# Altium schematic sheet MCU_144_IOs.SchDoc: MCU 144 I/Os
size A4; Date: Not used; ApprovedBy: Not used; CheckedBy: Not used; Author: Not used; CompanyName: STMicroelectronics; DrawnBy: Not used; Engineer: Not used; Organization: Not used; Address1: Not used; Address2: Not used; Address3: Not used; Address4: Not used; DocumentNumber: 3; Revision: Not used; SheetNumber: 3; SheetTotal: 9; CurrentTime: Not used; CurrentDate: Not used; Time: Not used; DocumentFullPathAndName: Not used; DocumentName: Not used; ModifiedDate: Not used; ImagePath: Not used; ProjectName: Not used; Application_BuildNumber: Not used
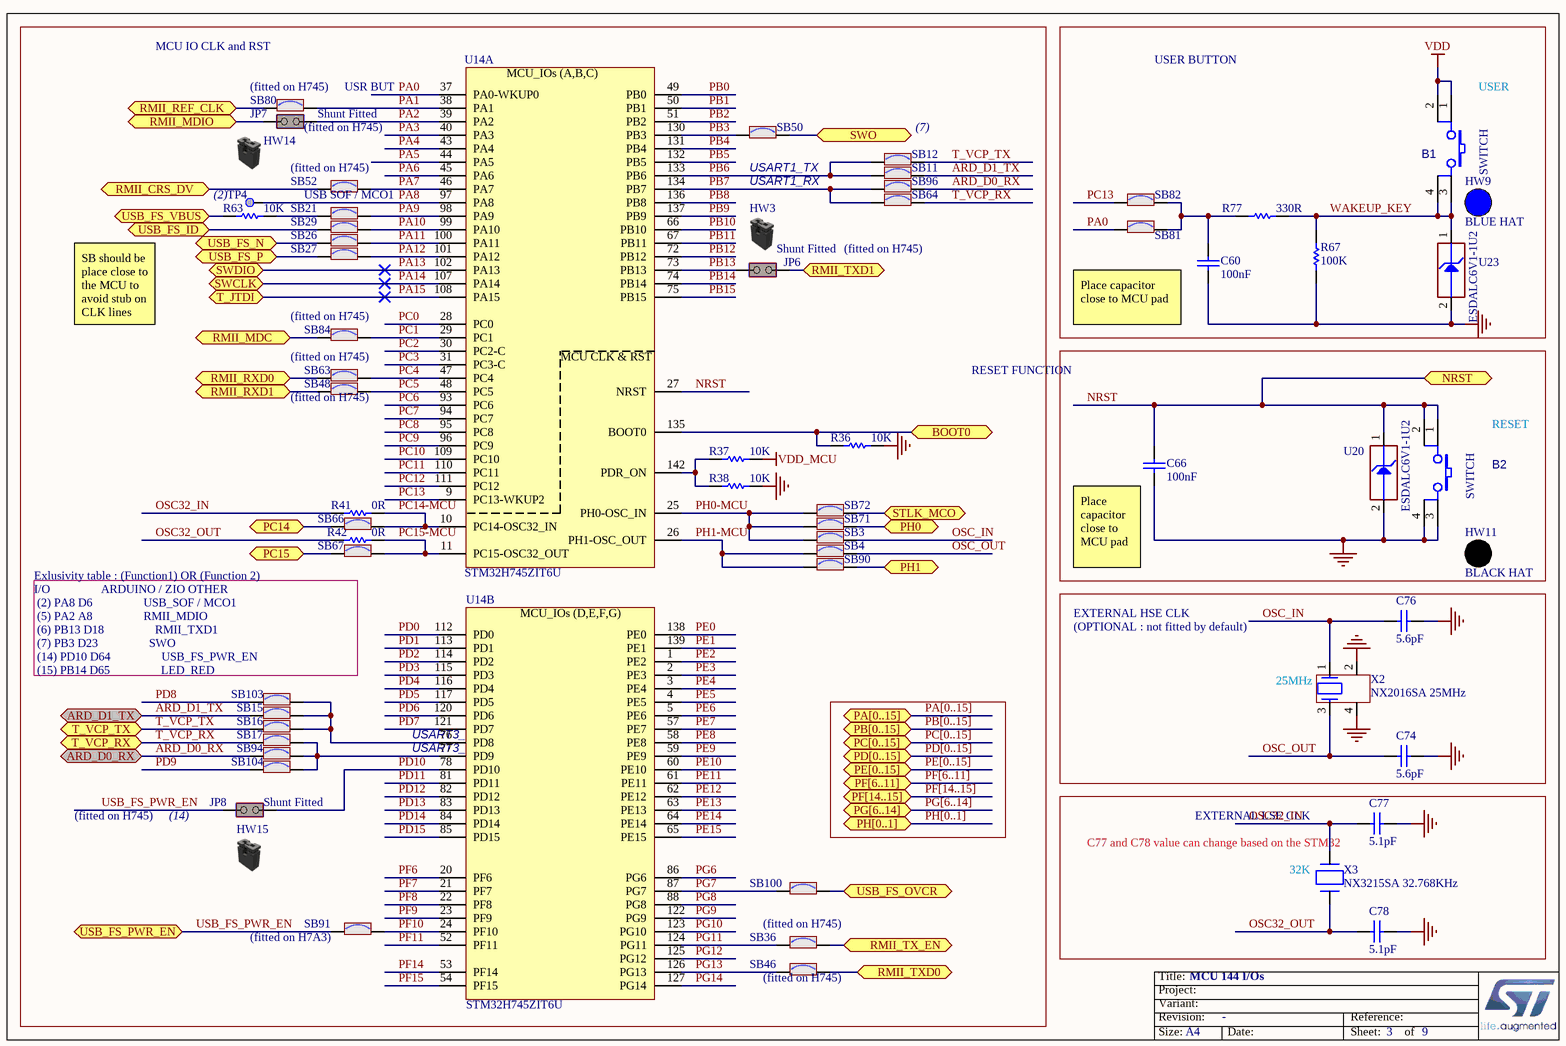
[diagram p0: MCU_144_IOs.SchDoc]

## Parts
B1  value SWITCH  [SWI_WEALTHMETAL_TD-0341_4P_BLUE]  (hidden comment: SW-PUSH-CMS)
B2  value SWITCH  [SWI_WEALTHMETAL_TD-0341_4P_BLACK]  (hidden comment: SW-PUSH-CMS)
C60  value 100nF  [C0603]  (hidden comment: Capacitor)
C66  value 100nF  [C0603]  (hidden comment: Capacitor)
C74  value 5.6pF  [C0402]  (hidden comment: Capacitor)
C76  value 5.6pF  [C0402]  (hidden comment: Capacitor)
C77  value 5.1pF  [C0603]  (hidden comment: Capacitor)
C78  value 5.1pF  [C0603]  (hidden comment: Capacitor)
HW3  Shunt Black 2.54mm  (value not drawn)  (mechanical)
HW9  value BLUE HAT  (hidden comment: BUTTON_HAT_BLUE)  (mechanical)
HW11  value BLACK HAT  (hidden comment: BUTTON_HAT_BLACK)  (mechanical)
HW14  Shunt Black 2.54mm  (value not drawn)  (mechanical)
HW15  Shunt Black 2.54mm  (value not drawn)  (mechanical)
JP6  value Shunt Fitted  [CON_SAMTEC_TSW-102-07-G-S]  (hidden comment: Jumper_Header 2x1 Fitted)
JP7  value Shunt Fitted  [CON_SAMTEC_TSW-102-07-G-S]  (hidden comment: Jumper_Header 2x1 Fitted)
JP8  value Shunt Fitted  [CON_SAMTEC_TSW-102-07-G-S]  (hidden comment: Jumper_Header 2x1 Fitted)
R36  value 10K  [R0603]  (hidden comment: Resistor)
R37  value 10K  [R0603]  (hidden comment: Resistor)
R38  value 10K  [R0603]  (hidden comment: Resistor)
R41  value 0R  [R0603]  (hidden comment: Resistor)
R42  value 0R  [R0603]  (hidden comment: Resistor)
R63  value 10K  [R0402]  (hidden comment: Resistor)
R67  value 100K  [R0603]  (hidden comment: Resistor)
R77  value 330R  [R0603]  (hidden comment: Resistor)
SB3  SB_ON  [SOLDER-BRIDGE_R0603-0R]  (value not drawn)
SB4  SB_ON  [SOLDER-BRIDGE_R0603-0R]  (value not drawn)
SB11  SB_ON  [SOLDER-BRIDGE_R0603-0R]  (value not drawn)
SB12  SB_ON  [SOLDER-BRIDGE_R0603-0R]  (value not drawn)
SB15  SB_ON  [SOLDER-BRIDGE_R0603-0R]  (value not drawn)
SB16  SB_ON  [SOLDER-BRIDGE_R0603-0R]  (value not drawn)
SB17  SB_ON  [SOLDER-BRIDGE_R0603-0R]  (value not drawn)
SB21  SB_ON  [SOLDER-BRIDGE_R0603-0R]  (value not drawn)
SB26  SB_ON  [SOLDER-BRIDGE_R0603-0R]  (value not drawn)
SB27  SB_ON  [SOLDER-BRIDGE_R0603-0R]  (value not drawn)
SB29  SB_ON  [SOLDER-BRIDGE_R0603-0R]  (value not drawn)
SB36  SB_ON  [SOLDER-BRIDGE_R0603-0R]  (value not drawn)
SB46  SB_ON  [SOLDER-BRIDGE_R0603-0R]  (value not drawn)
SB48  SB_ON  [SOLDER-BRIDGE_R0603-0R]  (value not drawn)
SB50  SB_ON  [SOLDER-BRIDGE_R0603-0R]  (value not drawn)
SB52  SB_ON  [SOLDER-BRIDGE_R0603-0R]  (value not drawn)
SB63  SB_ON  [SOLDER-BRIDGE_R0603-0R]  (value not drawn)
SB64  SB_ON  [SOLDER-BRIDGE_R0603-0R]  (value not drawn)
SB66  SB_ON  [SOLDER-BRIDGE_R0603-0R]  (value not drawn)
SB67  SB_ON  [SOLDER-BRIDGE_R0603-0R]  (value not drawn)
SB71  SB_ON  [SOLDER-BRIDGE_R0603-0R]  (value not drawn)
SB72  SB_ON  [SOLDER-BRIDGE_R0603-0R]  (value not drawn)
SB80  SB_ON  [SOLDER-BRIDGE_R0603-0R]  (value not drawn)
SB81  SB_ON  [SOLDER-BRIDGE_R0603-0R]  (value not drawn)
SB82  SB_ON  [SOLDER-BRIDGE_R0603-0R]  (value not drawn)
SB84  SB_ON  [SOLDER-BRIDGE_R0603-0R]  (value not drawn)
SB90  SB_ON  [SOLDER-BRIDGE_R0603-0R]  (value not drawn)
SB91  SB_ON  [SOLDER-BRIDGE_R0603-0R]  (value not drawn)
SB94  SB_ON  [SOLDER-BRIDGE_R0603-0R]  (value not drawn)
SB96  SB_ON  [SOLDER-BRIDGE_R0603-0R]  (value not drawn)
SB100  SB_ON  [SOLDER-BRIDGE_R0603-0R]  (value not drawn)
SB103  SB_ON  [SOLDER-BRIDGE_R0603-0R]  (value not drawn)
SB104  SB_ON  [SOLDER-BRIDGE_R0603-0R]  (value not drawn)
TP4  Test Point  [TP_SMD_1MM]  (value not drawn)  (no BOM)
U14  value STM32H745ZIT6U  [ICC_LQFP144_20X20_P050_SOCKET_YAMAICHI_IC149-144-145-B5_NM]  (hidden comment: STM32H7_LQFP144_SMPS)  (parts A,B of 3)
U20  value ESDALC6V1-1U2  [ESD_ST0201]  (hidden comment: ESD-TRANSIL)
U23  value ESDALC6V1-1U2  [ESD_ST0201]  (hidden comment: ESD-TRANSIL)
X2  value NX2016SA 25MHz  [CRY_NX2016SA_4P]  (hidden comment: XTAL_4_PINS)
X3  value NX3215SA 32.768KHz  [CRY_NX3215SA_2P]  (hidden comment: XTAL_2_PINS)

## Ports
ARD_D0_RX (bidir), ARD_D1_TX (bidir), BOOT0 (bidir), NRST (bidir), PA[0..15] (bidir), PB[0..15] (bidir), PC14 (bidir), PC15 (bidir), PC[0..15] (bidir), PD[0..15] (bidir), PE[0..15] (bidir), PF[6..11] (bidir), PF[14..15] (bidir), PG[6..14] (bidir), PH0 (bidir), PH1 (bidir), PH[0..1] (bidir), RMII_CRS_DV (bidir), RMII_MDC (bidir), RMII_MDIO (bidir), RMII_REF_CLK (bidir), RMII_RXD0 (bidir), RMII_RXD1 (bidir), RMII_TX_EN (bidir), RMII_TXD0 (bidir), RMII_TXD1 (bidir), STLK_MCO (bidir), SWCLK (bidir), SWDIO (bidir), SWO (bidir), T_JTDI (bidir), T_VCP_RX (bidir), T_VCP_TX (bidir), USB_FS_ID (bidir), USB_FS_N (bidir), USB_FS_OVCR, USB_FS_P (bidir), USB_FS_PWR_EN, USB_FS_VBUS (bidir)

## Nets
GND: B2.3 B2.4 C60.1 C66.1 C74.2 C76.2 C77.2 C78.2 R36.2 R38.2 R67.1 U20.2(GND) U23.2(GND) X2.2 X2.4
VDD: B1.1 B1.2
VDD_MCU: R37.2
ARD_D0_RX: SB94.2 SB96.1 ; port ARD_D0_RX
ARD_D1_TX: SB11.1 SB15.2 ; port ARD_D1_TX
BOOT0: R36.1 U14.135(BOOT0) ; port BOOT0
NRST: B2.1 B2.2 C66.2 U14.27(NRST) U20.1(IO1) ; port NRST
OSC32_IN: C77.1 R41.2 X3.2(X2)
OSC32_OUT: C78.1 R42.1 X3.1(X1)
OSC_IN: C76.1 SB3.2 X2.1
OSC_OUT: C74.1 SB4.2 X2.3
PA0: SB81.2 U14.37(PA0-WKUP0)
PA1: SB80.1 U14.38(PA1)
PA2: JP7.2(NO) U14.39(PA2)
PA3: U14.40(PA3)
PA4: U14.43(PA4)
PA5: U14.44(PA5)
PA6: U14.45(PA6)
PA7: SB52.1 U14.46(PA7)
PA8: TP4.1 U14.97(PA8)
PA9: SB21.1 U14.98(PA9)
PA10: SB29.1 U14.99(PA10)
PA11: SB26.1 U14.100(PA11)
PA12: SB27.1 U14.101(PA12)
PA13: U14.102(PA13) ; port SWDIO
PA14: U14.107(PA14) ; port SWCLK
PA15: U14.108(PA15) ; port T_JTDI
PB0: U14.49(PB0)
PB1: U14.50(PB1)
PB2: U14.51(PB2)
PB3: SB50.2 U14.130(PB3)
PB4: U14.131(PB4)
PB5: U14.132(PB5)
PB6: SB11.2 SB12.2 U14.133(PB6)
PB7: SB64.2 SB96.2 U14.134(PB7)
PB8: U14.136(PB8)
PB9: U14.137(PB9)
PB10: U14.66(PB10)
PB11: U14.67(PB11)
PB12: U14.72(PB12)
PB13: JP6.1(COMMON) U14.73(PB13)
PB14: U14.74(PB14)
PB15: U14.75(PB15)
PC0: U14.28(PC0)
PC1: SB84.2 U14.29(PC1)
PC2: U14.30(PC2-C)
PC3: U14.31(PC3-C)
PC4: SB63.2 U14.47(PC4)
PC5: SB48.2 U14.48(PC5)
PC6: U14.93(PC6)
PC7: U14.94(PC7)
PC8: U14.95(PC8)
PC9: U14.96(PC9)
PC10: U14.109(PC10)
PC11: U14.110(PC11)
PC12: U14.111(PC12)
PC13: SB82.2 U14.9(PC13-WKUP2)
PC14: SB66.1 ; port PC14
PC14-MCU: R41.1 SB66.2 U14.10(PC14-OSC32_IN)
PC15: SB67.1 ; port PC15
PC15-MCU: R42.2 SB67.2 U14.11(PC15-OSC32_OUT)
PD0: U14.112(PD0)
PD1: U14.113(PD1)
PD2: U14.114(PD2)
PD3: U14.115(PD3)
PD4: U14.116(PD4)
PD5: U14.117(PD5)
PD6: U14.120(PD6)
PD7: U14.121(PD7)
PD8: SB103.1
PD9: SB104.1
PD10: JP8.2(NO) U14.78(PD10)
PD11: U14.81(PD11)
PD12: U14.82(PD12)
PD13: U14.83(PD13)
PD14: U14.84(PD14)
PD15: U14.85(PD15)
PE0: U14.138(PE0)
PE1: U14.139(PE1)
PE2: U14.1(PE2)
PE3: U14.2(PE3)
PE4: U14.3(PE4)
PE5: U14.4(PE5)
PE6: U14.5(PE6)
PE7: U14.57(PE7)
PE8: U14.58(PE8)
PE9: U14.59(PE9)
PE10: U14.60(PE10)
PE11: U14.61(PE11)
PE12: U14.62(PE12)
PE13: U14.63(PE13)
PE14: U14.64(PE14)
PE15: U14.65(PE15)
PF6: U14.20(PF6)
PF7: U14.21(PF7)
PF8: U14.22(PF8)
PF9: U14.23(PF9)
PF10: SB91.1 U14.24(PF10)
PF11: U14.52(PF11)
PF14: U14.53(PF14)
PF15: U14.54(PF15)
PG6: U14.86(PG6)
PG7: SB100.2 U14.87(PG7)
PG8: U14.88(PG8)
PG9: U14.122(PG9)
PG10: U14.123(PG10)
PG11: SB36.2 U14.124(PG11)
PG12: U14.125(PG12)
PG13: SB46.2 U14.126(PG13)
PG14: U14.127(PG14)
PH0: SB71.2 ; port PH0
PH0-MCU: SB3.1 SB71.1 SB72.1 U14.25(PH0-OSC_IN)
PH1: SB90.2 ; port PH1
PH1-MCU: SB4.1 SB90.1 U14.26(PH1-OSC_OUT)
RMII_CRS_DV: SB52.2 ; port RMII_CRS_DV
RMII_MDC: SB84.1 ; port RMII_MDC
RMII_MDIO: JP7.1(COMMON) ; port RMII_MDIO
RMII_REF_CLK: SB80.2 ; port RMII_REF_CLK
RMII_RXD0: SB63.1 ; port RMII_RXD0
RMII_RXD1: SB48.1 ; port RMII_RXD1
RMII_TX_EN: SB36.1 ; port RMII_TX_EN
RMII_TXD0: SB46.1 ; port RMII_TXD0
RMII_TXD1: JP6.2(NO) ; port RMII_TXD1
STLK_MCO: SB72.2 ; port STLK_MCO
SWO: SB50.1 ; port SWO
T_VCP_RX: SB17.2 SB64.1 ; port T_VCP_RX
T_VCP_TX: SB12.1 SB16.2 ; port T_VCP_TX
USB_FS_ID: SB29.2 ; port USB_FS_ID
USB_FS_N: SB26.2 ; port USB_FS_N
USB_FS_OVCR: SB100.1 ; port USB_FS_OVCR
USB_FS_P: SB27.2 ; port USB_FS_P
USB_FS_PWR_EN: JP8.1(COMMON) SB91.2 ; port USB_FS_PWR_EN
USB_FS_VBUS: R63.1 ; port USB_FS_VBUS
WAKEUP_KEY: B1.3 B1.4 R67.2 R77.2 U23.1(IO1)
NetC60_2: C60.2 R77.1 SB81.1 SB82.1
NetR37_1: R37.1 R38.1 U14.142(PDR_ON)
NetR63_2: R63.2 SB21.2
NetSB15_1: SB15.1 SB16.1 SB103.2 U14.76(PD8)
NetSB17_1: SB17.1 SB94.1 SB104.2 U14.77(PD9)

## Buses and harness runs
bus PA[0..15] = port PA[0..15]
bus PB[0..15] = port PB[0..15]
bus PC[0..15] = port PC[0..15]
bus PD[0..15] = port PD[0..15]
bus PE[0..15] = port PE[0..15]
bus PF[6..11] = port PF[6..11]
bus PF[14..15] = port PF[14..15]
bus PG[6..14] = port PG[6..14]
bus PH[0..1] = port PH[0..1]

## Notes on the sheet
- MCU IO CLK and RST
- (near SB80) (fitted on H745)
- USR BUT
- USER BUTTON
- (near B1) USER
- (near SB52) (fitted on H745)
- (fitted on H745)
- USART1_TX
- USART1_RX
- (7)
- (2)
- (near SB52) USB SOF / MCO1
- SB should be place close to the MCU to avoid stub on CLK lines
- (near SB84) (fitted on H745)
- Place capacitor close to MCU pad
- RESET FUNCTION
- (near SB48) (fitted on H745)
- RESET
- Exlusivity table : (Function1) OR (Function 2)
- (near C66) Place capacitor close to MCU pad
- EXTERNAL HSE CLK
- (OPTIONAL : not fitted by default)
- I/O	                ARDUINO / ZIO	OTHER
  (2)	PA8	D6	                USB_SOF / MCO1
  (5)	PA2	A8	                RMII_MDIO
  (6)	PB13	D18	                RMII_TXD1
  (7)	PB3	D23	                SWO
  (14)	PD10	D64	                USB_FS_PWR_EN
  (15)	PB14	D65	                LED_RED
- (near X2) 25MHz
- USART3_TX
- USART3_RX
- (14)
- C77 and C78 value can change based on the STM32
- EXTERNAL LSE CLK
- (near SB36) (fitted on H745)
- (near X3) 32K
- (near SB91) (fitted on H7A3)
- (near SB46) (fitted on H745)
- Title:
- Project:
- Size:
- Revision:
- Variant:
- A4
- -
- Date:
- Reference:
- Sheet:
- of
- (in symbol MCD-01401, part A) MCU_IOs (A,B,C); MCU CLK & RST
- (in symbol MCD-01401, part B) MCU_IOs (D,E,F,G)

## Library data of the parts
B1 = MCD-00002: Non-Open Push-Button 0.1A 24V; Manufacturer_Part_Number: TD-0341; Manufacturer: WEALTHMETAL; Part_Type: Misc; Provided_By: SUBCO; Internal_Part_Number: MCD-00002; ComponentLink1Description: Datasheet; Status: Released; ComponentLink1URL: http://tunmcdsvn.tun.st.com/Component_Datasheet_Library/Trunk/Misc/Wealthmetal_Tact-Switch_TD0341; ECCN_US: n/a; ECCN_EU: n/a
B2 = MCD-00001: Non-Open Push-Button 0.1A 24V BLACK; Manufacturer_Part_Number: TD-0341; Manufacturer: WEALTHMETAL; Part_Type: Misc; Provided_By: SUBCO; Internal_Part_Number: MCD-00001; ComponentLink1Description: Datasheet; Status: Released; ComponentLink1URL: http://tunmcdsvn.tun.st.com/Component_Datasheet_Library/Trunk/Misc/Wealthmetal_Tact-Switch_TD0341; ECCN_US: n/a; ECCN_EU: n/a
C60 C66 = MCD-00237: Capacitor, MLCC, 100nF, 6V3, X5R, 10%, 0603, T=0,8mm; Manufacturer_Part_Number: CC0603KRX5R5BB104; Manufacturer: YAGEO; Provided_By: SUBCO; ECCN_US: EAR99; ECCN_EU: NEC; Internal_Part_Number: MCD-00237; ComponentLink1Description: Datasheet; Status: Released; Part_Type: Capacitor; Package: C0603; ComponentLink1URL: http://tunmcdsvn.tun.st.com/Component_Datasheet_Library/Trunk/Capacitors/Yageo_Multilayer_capacitor_X5R_series_100pF_to_100uF
C74 C76 = MCD-01374: Capacitor, MLCC, 5.6pF, 50V, NPO, 5%, 0402, T=0,5mm; Manufacturer_Part_Number: CC0402BRNPO9BN5R6; Manufacturer: YAGEO; Provided_By: SUBCO; Internal_Part_Number: MCD-01374; Status: Released; Part_Type: Capacitor; Package: C0402; ComponentLink1Description: Datasheet; ComponentLink1URL: http://tunmcdsvn.tun.st.com/Component_Datasheet_Library/Trunk/Capacitors/Yageo_Capacitor_NP0_16V-to-50V; ECCN_US: N/A; ECCN_EU: N/A
C77 C78 = MCD-01367: Capacitor,5.1pF,0.25pF,50V,NPO,0603; Manufacturer_Part_Number: CC0603CRNPO9BN5R1; Manufacturer: YAGEO; Provided_By: SUBCO; Internal_Part_Number: MCD-01367; Status: Released; Part_Type: Capacitor; Package: C0603; ComponentLink1Description: Datasheet; ComponentLink1URL: http://tunmcdsvn.tun.st.com/Component_Datasheet_Library/Trunk/Capacitors/Yageo_Capacitor_NP0_16V-to-50V; ECCN_US: N/A; ECCN_EU: N/A
HW3 HW14 HW15 = MCD-00043: SHUNT 2.54mm BLACK; Manufacturer_Part_Number: SNT-100-BK-G; Manufacturer: SAMTEC; Part_Type: Mechanical; Alternate_Manufacturer_Part_Number: 316102S111A; Alternate_Manufacturer: JIUBABA; Provided_By: SUBCO; Internal_Part_Number: MCD-00043; ComponentLink1Description: Datasheet; Status: Released; ComponentLink1URL: http://tunmcdsvn.tun.st.com/Component_Datasheet_Library/Trunk/Connectors/Samtec_Shunt_Jumper_SNT100; ECCN_US: n/a; ECCN_EU: n/a
HW9 = MCD-00634: Blue Hat for switch TD0341X-G01-BLU; Part_Type: Mechanical; Manufacturer_Part_Number: 988.16.09.3.00002_SH-517; Manufacturer: JIUBABA; Provided_By: SUBCO; Internal_Part_Number: MCD-00634; Status: Released; ComponentLink1Description: Datasheet; ComponentLink1URL: http://tunmcdsvn.tun.st.com/Component_Datasheet_Library/Trunk/Mechanical/Jiubaba_HAT_SH-517; ECCN_US: n/a; ECCN_EU: n/a
HW11 = MCD-00635: Black Hat for switch TD0341X-G01-BLA; Part_Type: Mechanical; Manufacturer_Part_Number: 988.16.09.3.00003_SH-517; Manufacturer: JIUBABA; Provided_By: SUBCO; Internal_Part_Number: MCD-00635; Status: Released; ComponentLink1Description: Datasheet; ComponentLink1URL: http://tunmcdsvn.tun.st.com/Component_Datasheet_Library/Trunk/Mechanical/Jiubaba_HAT_SH-517; ECCN_US: n/a; ECCN_EU: n/a
JP6-JP8 = MCD-00683: Header, 2x1, 2,54mm, VR, TH, Height 5.84mm/2.54mm - Shunt Fitted by default; Part_Type: Connector; Manufacturer_Part_Number: TSW-102-07-x-S; Manufacturer: SAMTEC; Alternate_Manufacturer_Part_Number: 313102S111116; Alternate_Manufacturer: LIANYI; Provided_By: SUBCO; Internal_Part_Number: MCD-00683; Status: Released; ComponentLink1Description: Datasheet; ComponentLink1URL: http://tunmcdsvn.tun.st.com/Component_Datasheet_Library/Trunk/Connectors/Samtec_TSW-HTSW-series; ECCN_US: n/a; ECCN_EU: n/a
R36-R38 = MCD-00220: Resistor,10K,0603,1%,1/10W; Manufacturer_Part_Number: RC0603FR-0710KL; Manufacturer: YAGEO; Provided_By: SUBCO; ECCN_US: EAR99; ECCN_EU: NEC; Internal_Part_Number: MCD-00220; Status: Released; Part_Type: Resistor; ComponentLink1Description: Datasheet; Package: R0603; ComponentLink1URL: http://tunmcdsvn.tun.st.com/Component_Datasheet_Library/Trunk/Resistors/Yageo_Resistor_RC0603-series
R41 R42 = MCD-00056: Resistor,0R,0603,5%,1/10W; Manufacturer_Part_Number: RC0603JR-070RL; Manufacturer: YAGEO; Provided_By: SUBCO; ECCN_US: EAR99; ECCN_EU: NEC; Internal_Part_Number: MCD-00056; ComponentLink1Description: Datasheet; Status: Released; Part_Type: Resistor; Package: R0603; ComponentLink1URL: http://tunmcdsvn.tun.st.com/Component_Datasheet_Library/Trunk/Resistors/Yageo_Resistor_RC0603-series
R63 = MCD-00053: Resistor,10K,0402,1%,1/16W; Manufacturer_Part_Number: RC0402FR-0710KL; Manufacturer: YAGEO; Provided_By: SUBCO; ECCN_US: EAR99; ECCN_EU: NEC; Internal_Part_Number: MCD-00053; Status: Released; Part_Type: Resistor; Package: R0402; ComponentLink1Description: Datasheet; ComponentLink1URL: http://tunmcdsvn.tun.st.com/Component_Datasheet_Library/Trunk/Resistors/Yageo_Resistor_RC0402-series
R67 = MCD-00223: Resistor,100K,0603,1%,1/10W; Manufacturer_Part_Number: RC0603FR-07100KL; Manufacturer: YAGEO; Provided_By: SUBCO; ECCN_US: EAR99; ECCN_EU: NEC; Internal_Part_Number: MCD-00223; ComponentLink1Description: Datasheet; Status: Released; Part_Type: Resistor; Package: R0603; ComponentLink1URL: http://tunmcdsvn.tun.st.com/Component_Datasheet_Library/Trunk/Resistors/Yageo_Resistor_RC0603-series
R77 = MCD-00197: Resistor,330R,0603,1%,1/10W; Manufacturer_Part_Number: RC0603FR-07330RL; Manufacturer: YAGEO; BMS_Part_Number: 9129729; Provided_By: SUBCO; ECCN_US: EAR99; ECCN_EU: NEC; Internal_Part_Number: MCD-00197; Status: Released; Part_Type: Resistor; Package: R0603; ComponentLink1Description: Datasheet; ComponentLink1URL: http://tunmcdsvn.tun.st.com/Component_Datasheet_Library/Trunk/Resistors/Yageo_Resistor_RC0603-series
SB3 SB4 SB11 SB12 SB15-SB17 SB21 SB26 SB27 SB29 SB36 SB46 SB48 SB50 SB52 SB63 SB64 SB66 SB67 SB71 SB72 SB80-SB82 SB84 SB90 SB91 SB94 SB96 SB100 SB103 SB104 = MCD-00071: Solder Bridge ON; Part_Type: Mechanical; Manufacturer_Part_Number: RC0603JR-070RL; Manufacturer: YAGEO; Provided_By: SUBCO; Internal_Part_Number: MCD-00071; Status: Released; ComponentLink1Description: Datasheet; Package: SB0603; ComponentLink1URL: http://tunmcdsvn.tun.st.com/Component_Datasheet_Library/Trunk/Resistors/Yageo_Resistor_RC0603-series; ECCN_US: n/a; ECCN_EU: n/a
TP4 = MCD-00074: Test Point 1mm; Part_Type: Mechanical; Internal_Part_Number: MCD-00074; Status: Released; Manufacturer_Part_Number: n/a; Manufacturer: n/a; ComponentLink1Description: Datasheet; ComponentLink1URL: http://na; Provided_By: n/a; ECCN_US: n/a; ECCN_EU: n/a
U14 = MCD-01401: STM32H745ZIT6U, LQFP144 package, 20x20, with socket footprint; Part_Type: IC; Manufacturer: STMICROELECTRONICS; BMS_Part_Number: 9175297 (cut 2.0); ECCN_US: 3A991A2; ECCN_EU: NEC; Provided_By: SUBCO with ST control; Internal_Part_Number: MCD-01401; Status: Released; Manufacturer_Part_Number: STM32H745ZIT6U; Package: LQFP144 20x20; ComponentLink1Description: Datasheet; ComponentLink1URL: http://tunmcdsvn.tun.st.com/Component_Datasheet_Library/Trunk/IC/STM_STM32L552ZET6QU
U20 U23 = MCD-00170: ESD protection 6V1; Part_Type: Diode; Manufacturer: STMICROELECTRONICS; BMS_Part_Number: 9151132; Provided_By: SUBCO with ST control; ECCN_US: EAR99; ECCN_EU: NEC; Internal_Part_Number: MCD-00170; Status: Released; Manufacturer_Part_Number: ESDALC6V1-1U2; ComponentLink1Description: Datasheet; ComponentLink1URL: http://tunmcdsvn.tun.st.com/Component_Datasheet_Library/Trunk/Diodes/STM_ESD_ESDALC6V1-1U2
X2 = MCD-01364: Crystal 25MHz, 6pF, +-20ppm, 80ohms max, SMD; Part_Type: Crystal_Osc; Manufacturer_Part_Number: NX2016SA 25MHz EXS00A-CS11321; Manufacturer: NDK; BMS_Part_Number: 9157044; Provided_By: SUBCO; ECCN_US: EAR99; ECCN_EU: NEC; Internal_Part_Number: MCD-01364; Status: Released; Package: NX2016SA; ComponentLink1Description: Datasheet; ComponentLink1URL: http://tunmcdsvn.tun.st.com/Component_Datasheet_Library/Trunk/Crystal_Osc/NDK_NX2016SA 25MHz EXS00A-CS11321 (EXS10B-28187); Order_Code_Digikey: 644-1367
X3 = MCD-00091: Crystal 32.768kHz, 6pF, +-20ppm, 50Kohms max, SMD; Manufacturer_Part_Number: NX3215SA 32.768KHz EXS00A-MU00525; Manufacturer: NDK; Part_Type: Crystal_Osc; BMS_Part_Number: 9157034; Provided_By: SUBCO; ECCN_US: EAR99; ECCN_EU: NEC; Internal_Part_Number: MCD-00091; ComponentLink1Description: Datasheet; Status: Released; ComponentLink1URL: http://tunmcdsvn.tun.st.com/Component_Datasheet_Library/Trunk/Crystal_Osc/NDK_Crystal-For-ST_NX3215SA 32.768KHz EXS00A-MU00525 (EXS10B-21238); Order_Code_Digikey: 644-1386